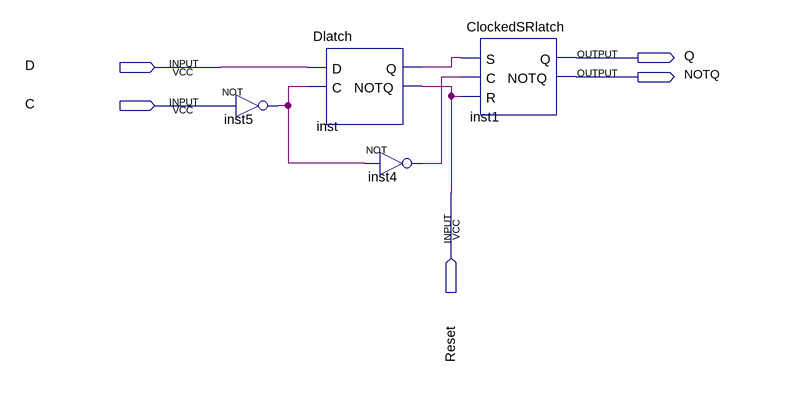
[diagram p0: schematic sheet]
// Quartus schematic PositiveEdgeTriggeredFlipFlop.bdf as structural Verilog: 4 symbols, 5 pins
module PositiveEdgeTriggeredFlipFlop (
  input  D,
  input  C,
  input  Reset,
  output Q,
  output NOTQ
);

  wire inst4_out, inst5_out, inst_q;

  not inst5 (inst5_out, C);
  Dlatch inst (.D(D), .C(inst5_out), .Q(inst_q), .NOTQ(Reset));
  not inst4 (inst4_out, inst5_out);
  ClockedSRlatch inst1 (.S(inst_q), .C(inst4_out), .R(Reset), .Q(Q), .NOTQ(NOTQ));
endmodule
